# Altium schematic sheet communication.SchDoc
size A4; SheetNumber: 8
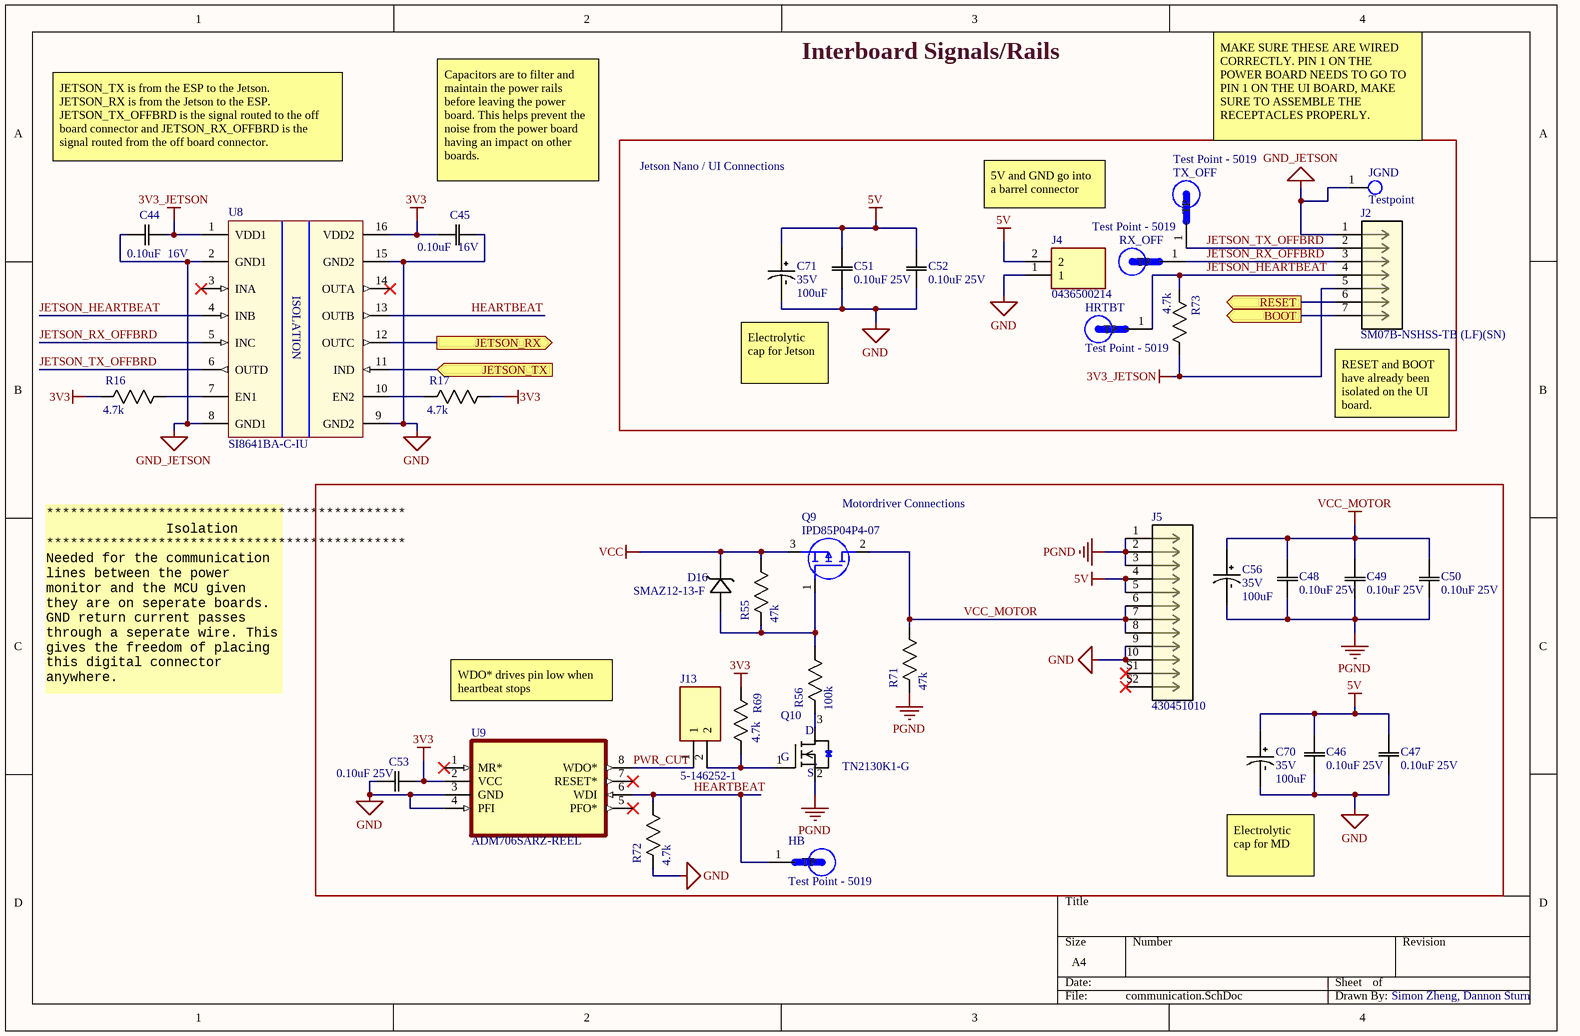
[diagram p0: communication.SchDoc]

## Parts
C44  Rating: 16V  [0603]  (hidden comment: 0.10uF)
C45  Rating: 16V  [0603]  (hidden comment: 0.10uF)
C46  0.10uF 25V  [0603]
C47  0.10uF 25V  [0603]
C48  0.10uF 25V  [0805]
C49  0.10uF 25V  [0603]
C50  0.10uF 25V  [0603]
C51  0.10uF 25V  [0603]
C52  0.10uF 25V  [0603]
C53  0.10uF 25V  [0603]
C56  Rating: 35V  [CAP POL ALU 6.3x5.8]  (hidden comment: 100uF)
C70  Rating: 35V  [CAP POL ALU 6.3x5.8]  (hidden comment: 100uF)
C71  Rating: 35V  [CAP POL ALU 6.3x5.8]  (hidden comment: 100uF)
D16  SMAZ12-13-F  [SMA_DIO-L]
HB  Test Point - 5019  [TP380X203]
HRTBT  Test Point - 5019  [TP380X203]
J2  SM07B-NSHSS-TB (LF)(SN)  [JST_SM07B-NSHSS-TB_(LF)(SN)]
J4  0436500214  [43650-0214]
J5  430451010  [CON_430451010_MOL]
J13  5-146252-1  [TE_5-146252-1]
JGND  Testpoint  [TP_1mm]
Q9  IPD85P04P4-07  [DPAK (TO-252)]
Q10  TN2130K1-G  [SOT95P237X112-3N]
R16  4.7k  [0603]
R17  4.7k  [0603]
R55  47k  [0603]
R56  100k  [0603]
R69  4.7k  [0603]
R71  47k  [0603]
R72  4.7k  [0603]
R73  4.7k  [0603]
RX_OFF  Test Point - 5019  [TP380X203]
TX_OFF  Test Point - 5019  [TP380X203]
U8  SI8641BA-C-IU  [SOP64P600X175-16N]
U9  ADM706SARZ-REEL  [SOIC127P600X175-8N]

## Blocks framed on the sheet
Jetson Nano / UI Connections: C51 C52 C71 HRTBT J2 J4 JGND R73 RX_OFF TX_OFF
Motordriver Connections: C46-C50 C53 C56 C70 D16 HB J5 J13 Q9 Q10 R55 R56 R69 R71 R72 U9

## Ports
BOOT (out), JETSON_RX (out), JETSON_TX (in), RESET (out)

## Nets
3V3: C45.2(C2) C53.2(C2) R16.2(R2) R17.1(R1) R69.2(R2) U8.16(VDD2) U9.2(VCC)
3V3_JETSON: C44.2(C2) J2.5 R73.1(R1) U8.1(VDD1)
5V: C46.2(C2) C47.2(C2) C51.2(C2) C52.2(C2) C70.POS C71.POS J4.2 J5.4 J5.5
GND: C45.1(C1) C46.1(C1) C47.1(C1) C51.1(C1) C52.1(C1) C53.1(C1) C70.NEG C71.NEG J4.1 J5.9 J5.10 R72.2(R2) U8.9(GND2) U8.15(GND2) U9.3(GND) U9.4(PFI)
GND_JETSON: C44.1(C1) J2.1 JGND.1(TP) U8.2(GND1) U8.8(GND1)
PGND: C48.1(C1) C49.1(C1) C50.1(C1) C56.NEG J5.1 J5.2 J5.3 Q10.2(S) R71.2(R2)
VCC: D16.1 Q9.3(S) R55.1(R1)
VCC_MOTOR: C48.2(C2) C49.2(C2) C50.2(C2) C56.POS J5.6 J5.7 J5.8 Q9.2(D) R71.1(R1)
BOOT: J2.7 ; port BOOT
HEARTBEAT: HB.1(TP) R72.1(R1) U8.13(OUTB) U9.6(WDI)
JETSON_HEARTBEAT: HRTBT.1(TP) J2.4 R73.2(R2) U8.4(INB)
JETSON_RX: U8.12(OUTC) ; port JETSON_RX
JETSON_RX_OFFBRD: J2.3 RX_OFF.1(TP) U8.5(INC)
JETSON_TX: U8.11(IND) ; port JETSON_TX
JETSON_TX_OFFBRD: J2.2 TX_OFF.1(TP) U8.6(OUTD)
PWR_CUT: J13.1 U9.8(WDO*)
RESET: J2.6 ; port RESET
NetD16_2: D16.2 Q9.1(G) R55.2(R2) R56.1(R1)
NetJ13_2: J13.2 Q10.1(G) R69.1(R1)
NetQ10_3: Q10.3(D) R56.2(R2)
NetR16_1: R16.1(R1) U8.7(EN1)
NetR17_2: R17.2(R2) U8.10(EN2)

Not connected (* = marked no-connect by the designer): J5 S1* S2*; U8 3(INA)* 14(OUTA)*; U9 1(MR*)* 5(PFO*)* 7(RESET*)*

## Notes on the sheet
- Interboard Signals/Rails
- JETSON_TX is from the ESP to the Jetson. JETSON_RX is from the Jetson to the ESP.
  JETSON_TX_OFFBRD is the signal routed to the off board connector and JETSON_RX_OFFBRD is the signal routed from the off board connector.
- Capacitors are to filter and maintain the power rails before leaving the power board. This helps prevent the noise from the power board having an impact on other boards.
- (near JGND) MAKE SURE THESE ARE WIRED CORRECTLY. PIN 1 ON THE POWER BOARD NEEDS TO GO TO PIN 1 ON THE UI BOARD, MAKE SURE TO ASSEMBLE THE RECEPTACLES PROPERLY.
- 5V and GND go into a barrel connector
- Electrolytic cap for Jetson
- (near J2) RESET and BOOT have already been isolated on the UI board.
- *********************************************
  Isolation
  *********************************************
  Needed for the communication lines between the power monitor and the MCU given they are on seperate boards. GND return current passes through a seperate wire. This gives the freedom of placing this digital connector anywhere.
- WDO* drives pin low when heartbeat stops
- Electrolytic cap for MD
- Simon Zheng, Dannon Sturn
- (in symbol ISO SI8641BA-C-IU) ISOLATION

## Library data of the parts
C44 C45 = CAP 0.10uF 16V: CAP CER 0.10UF 16V X5R 0603; Tolerance: 10%; Temperature Coefficient: X5R; Value: 0.10uF; Part Number: CAP 0.10uF 16V; Package: 0603/0805; Operating Temperature: -55°C ~ 85°C
C46 C47 C49-C53 = CAP 0.10uF 25V: CAP CER 0.10UF 25V X7R 0603; Tolerance: 10%; Value: 0.10uF; Temperature Coefficient: X7R; Rating: 25V; Operating Temperature: -55°C ~ 125°C; Part Number: CAP 0.10uF 25V
C48 = CAP 0.10uF 25V: CAP CER 0.10UF 25V X7R 0805; Tolerance: 10%; Value: 0.10uF; Temperature Coefficient: X7R; Rating: 25V; Operating Temperature: -55°C ~ 125°C; Part Number: CAP 0.10uF 25V
C56 C70 C71 = CAP POL 100uF 35V SMD: Tolerance: 20%; Temperature Coefficient: Unspecified; ComponentLink1Description: Digikey Link; ComponentLink1URL: https://www.digikey.ca/product-detail/en/panasonic-electronic-components/ECA-1HM100I/P10425CT-ND/8603345; Package: RADIAL; Operating Temperature: -40°C ~ 85°C; Dimensions: 0.197" Dia (5.00mm); Value: 100uF; Part Number: CAP POL 100uF 35V SMD
D16 = DIODE ZENER 12V 1W: Zener Diode 12 V 1 W ±5% Surface Mount SMA; Mfr_Name: Diodes Inc; Type: DEV; Copyright: Copyright (C) 2021 Ultra Librarian. All rights reserved.; Manufacturer_Part_Number: SMAZ12-13-F; Digi-Key_Part_Number_1: SMAZ12-FDICT-ND; Digi-Key_Part_Number_2: SMAZ12-FDIDKR-ND; Digi-Key_Part_Number_3: SMAZ12-FDITR-ND; RefDes: RefDes; Supplier 1: Digi-Key; Supplier 2: Newark; Supplier 3: Digi-Key; Supplier Part Number 1: SMAZ12-FDICT-ND; Supplier Part Number 2: 23T8541; Supplier Part Number 3: SMAZ12-FDICT-ND; Part Number: DIODE ZENER 12V 1W; Manufacturer Part Number 1: SMAZ12-13-F; Supplier URL 1: https://www.digikey.com/en/products/detail/SMAZ12-13-F/SMAZ12-FDICT-ND/725073?curr=usd&utm_campaign=buynow&utm_medium=aggregator&utm_source=octopart
HB HRTBT RX_OFF TX_OFF = Test Point - 5019: PC Test Point, Miniature Phosphor Bronze, Silver Plating Surface Mount Mounting Type; MP: 5019; MF: Keystone Electronics; Value: *; Package: 2010 Keystone; Part Number: Test Point - 5019
J2 = CN 7POS JST NSH SMT RA: Connector Header Surface Mount, Right Angle 7 position 0.039" (1.00mm); MP: SM12B-NSHSS-TB (LF)(SN); MF: JST Sales America Inc.; Package: None; Check_prices: https://www.snapeda.com/parts/SM12B-NSHSS-TB%20(LF)(SN)/JST%20Sales%20America%20Inc./view-part/5255521/?ref=eda; Value: *; Availability: Unavailable; Price: None; SnapEDA_Link: https://www.snapeda.com/parts/SM12B-NSHSS-TB%20(LF)(SN)/JST%20Sales%20America%20Inc./view-part/5255521/?ref=snap; Supplier 1: Digi-Key; Supplier 2: Digi-Key; Supplier 3: Digi-Key; Supplier 4: Digi-Key; Supplier Part Number 1: 455-2771-1-ND; Supplier Part Number 2: 455-2771-1-ND; Supplier Part Number 3: 455-2771-6-ND; Supplier Part Number 4: 455-2771-2-ND; Part Number: CN 7POS JST NSH SMT RA; Supplier URL 1: https://www.digikey.ca/en/products/detail/jst-sales-america-inc/SM07B-NSHSS-TB-LF-SN/3313637; Pin Count: 7
J4 = CN HDR 2POS Molex 0436500214: Connector Header Surface Mount, Right Angle 2 position 0.118" (3.00mm); Manufacturer_Name: Molex; Datasheet Link: http://www.molex.com/webdocs/datasheets/pdf/en-us//0436500214_PCB_HEADERS.pdf; Manufacturer_Part_Number: 43650-0214; Supplier 1: Digi-Key; Supplier 2: Newark; Supplier 3: Arrow Electronics; Supplier 4: Mouser; Supplier Part Number 1: WM14310CT-ND; Supplier Part Number 2: 39AH6218; Supplier Part Number 3: 43650-0214; Supplier Part Number 4: 538-43650-0214; Part Number: CN HDR 2POS Molex 0436500214; Manufacturer Part Number 1: 0436500214; Supplier URL 1: https://www.digikey.com/en/products/detail/molex/0436500214/3310534
J5 = CN HDR 10POS MOLEX 430451010: Connector Header Surface Mount, Right Angle 10 position 0.118" (3.00mm); Mfr_Name: Molex Connector Corporation; Copyright: Copyright (C) 2021 Ultra Librarian. All rights reserved.; Manufacturer_Part_Number: 430451010; Digi-Key_Part_Number_1: WM3819TR-ND; Digi-Key_Part_Number_2: WM3819CT-ND; Digi-Key_Part_Number_3: WM3819DKR-ND; RefDes: RefDes; Type: DEV; Supplier 1: Digi-Key; Supplier 2: Newark; Supplier 3: Mouser; Supplier Part Number 1: WM3819CT-ND; Supplier Part Number 2: 03AH4054; Supplier Part Number 3: 538-43045-1010; Part Number: CN HDR 10POS MOLEX 430451010; Manufacturer Part Number 1: 430451010; Supplier URL 1: https://www.digikey.com/en/products/detail/molex/0430451010/2421710?s=N4IgTCBcDaICwGYAMcCsBGJmQF0C%2BQA
J13 = 5-146252-1: 2 Pin Jumper Male Pins and Cap; Package: None; Price: None; Value: *; MP: 5-146252-1; Availability: Unavailable; Supplier 1: Digi-Key; ComponentLink1Description: JumperPins; ComponentLink1URL: https://www.digikey.ca/en/products/detail/te-connectivity-amp-connectors/5-146252-1/2275768#; ComponentLink2Description: JumperCap; ComponentLink2URL: https://www.digikey.ca/en/products/detail/samtec-inc/SNT-100-BK-G/1756763; Supplier Part Number 1: A105225-ND; Part Number: 5-146252-1; Manufacturer Part Number 1: 5-146252-1; Supplier URL 1: https://www.digikey.com/en/products/detail/te-connectivity-amp-connectors/5-146252-1/2275768
JGND = TP_1MM: Part Number: TP_1MM
Q9 = MOSFET IPD85P04P4-07: P-Channel 40 V 85A (Tc) 88W (Tc) Surface Mount PG-TO252-3-313; Supplier 1: Digi-Key; Supplier 2: Mouser; Supplier 3: Digi-Key; Supplier Part Number 1: 448-IPD85P04P407ATMA1CT-ND; Supplier Part Number 2: 726-IPD85P04P4-07; Supplier Part Number 3: 448-IPD85P04P407ATMA1CT-ND; Part Number: MOSFET IPD85P04P4-07; Supplier URL 1: https://www.digikey.ca/en/products/detail/infineon-technologies/IPD85P04P407ATMA1/5960266
Q10 = MOSFET N-CH TN2130K1-G: N-Channel 300 V 85mA (Tj) 360mW (Tc) Surface Mount TO-236AB (SOT23); Mfr_Name: Microchip; Type: DEV; Copyright: Copyright (C) 2021 Ultra Librarian. All rights reserved.; Manufacturer_Part_Number: TN2130K1-G; Digi-Key_Part_Number_1: TN2130K1-GCT-ND; Digi-Key_Part_Number_2: TN2130K1-GDKR-ND; Digi-Key_Part_Number_3: TN2130K1-GTR-ND; RefDes: RefDes; Supplier 1: Digi-Key; Supplier Part Number 1: TN2130K1-GCT-ND; Part Number: MOSFET N-CH TN2130K1-G; Manufacturer Part Number 1: TN2130K1-G; Supplier URL 1: https://www.digikey.com/en/products/detail/microchip-technology/TN2130K1-G/4902939
R16 R17 R69 R72 R73 = RES 4.7k 1/8W - 5%: RES SMD 4.7k OHM 5% 1/8W 0603; Manufacturer Part Number 1: RMCF0603JT4K70; Power (Watts): 0.125W; Package: 0805; Value: 4.7k; Tolerance: 5%; Part Number: RES 4.7k 1/8W - 5%; Supplier 1: Digi-Key; Supplier Part Number 1: RMCF0603JT4K70CT-ND; Supplier URL 1: https://www.digikey.ca/en/products/detail/stackpole-electronics-inc/RMCF0603JT4K70/1757976
R55 R71 = RES 47k 1/8W - 5%: RES SMD 47k OHM 5% 1/8W 0603; Power (Watts): 0.125W; Package: 0805; Value: 47k; Tolerance: 5%; Part Number: RES 47k 1/8W - 5%
R56 = RES 100k 1/8W - 5%: RES SMD 100K OHM 5% 1/8W 0603; Power (Watts): 0.125W; Package: 0805; Value: 100k; Tolerance: 5%; Part Number: RES 100k 1/8W - 5%
U8 = ISO SI8641BA-C-IU: General Purpose Digital Isolator 1000Vrms 4 Channel 150Mbps 35kV/µs CMTI 16-QSOP (0.154", 3.90mm Width); Part Number: ISO SI8641BA-C-IU; Manufacturer Part Number 1: SI8641BA-C-IU; Supplier 1: Digi-Key; Supplier Part Number 1: SI8641BA-C-IU-ND; Supplier URL 1: https://www.digikey.ca/en/products/detail/skyworks-solutions-inc/SI8641BA-C-IU/4988416
U9 = ADM706SARZ-REEL: MF: Analog Devices; MP: ADM706SARZ-REEL; Package: SOIC-8 Analog Devices; Value: *; SnapEDA_Link: https://www.snapeda.com/parts/ADM706SARZ-REEL/Analog+Devices/view-part/?ref=snap; Digi-Key_Part_Number: ADM706SARZ-REELCT-ND; Check_prices: https://www.snapeda.com/parts/ADM706SARZ-REEL/Analog+Devices/view-part/?ref=eda; Purchase-URL: https://pricing.snapeda.com/search/part/ADM706SARZ-REEL/?ref=eda; Supplier 1: Digi-key; Supplier 2: Arrow Electronics; Supplier 3: Mouser; Supplier Part Number 1: ADM706SARZ-REELCT-ND; Supplier Part Number 2: ADM706SARZ-REEL; Supplier Part Number 3: 584-ADM706SARZ-R; Part Number: ADM706SARZ-REEL; Manufacturer Part Number 1: ADM706SARZ-REEL; Supplier URL 1: https://www.digikey.com/en/products/detail/analog-devices-inc/ADM706SARZ-REEL/993649